# Altium schematic sheet rs485.SchDoc
size A4
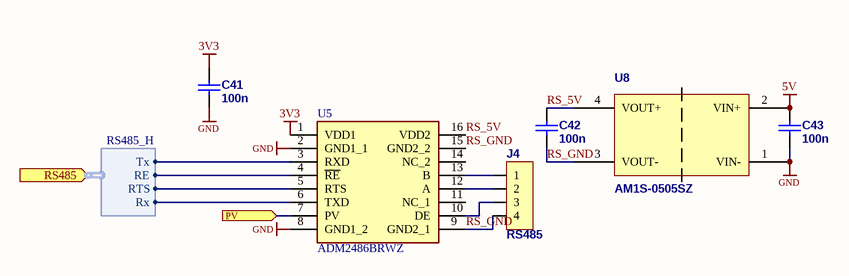
[diagram p0: rs485.SchDoc]

## Parts
C41  100n  [C0805]
C42  100n  [C0805]
C43  100n  [C0805]
J4  RS485  [15EDGRC-3.81/4P_WO_CN]
U5  ADM2486BRWZ  [SOIC127P1032X265-16N]
U8  AM1S-0505SZ  [AM1S-Z]

## Ports
PV (in), RS485 (in, harness RS485_H)

## Harnesses
RS485_H: RE, RTS, Rx, Tx

## Nets
3V3: C41.2 U5.1(VDD1)
5V: C43.1 U8.2(VIN+)
GND: C41.1 C43.2 U5.2(GND1_1) U5.8(GND1_2) U8.1(VIN-)
PV: U5.7(PV) ; port PV
RS_5V: C42.2 U5.16(VDD2) U8.4(VOUT+)
RS_GND: C42.1 J4.4 U5.9(GND2_1) U5.15(GND2_2) U8.3(VOUT-)
NetJ4_1: J4.1 U5.13(B)
NetJ4_2: J4.2 U5.12(A)
NetJ4_3: J4.3 U5.10(DE)
NetU5_3: U5.3(RXD) ; port RS485.Tx
NetU5_4: U5.4(~{RE}) ; port RS485.RE
NetU5_5: U5.5(RTS) ; port RS485.RTS
NetU5_6: U5.6(TXD) ; port RS485.Rx

Not connected (* = marked no-connect by the designer): U5 11(NC_1) 14(NC_2)

## Library data of the parts
C41-C43 = Cap: Capacitor; ComponentLink1Description: datasheet; ComponentLink2Description: supplier; Value: 100n
J4 = 2EDGVC-5.0-4P: Degson 20A, 320V, 4 Pole Plug-in Terminal Block
U5 = ADM2486BRWZ: Integrated Circuit; Manufacturer_Name: Analog Devices; Datasheet Link: http://componentsearchengine.com/Datasheets/1/ADM2486BRWZ.pdf; Height: 2.65mm; Manufacturer_Part_Number: ADM2486BRWZ; Mouser Part Number: 584-ADM2486BRWZ; Mouser Price/Stock: https://www.mouser.co.uk/ProductDetail/Analog-Devices/ADM2486BRWZ?qs=BpaRKvA4VqGSEWb6zK%252B8GA%3D%3D; Arrow Part Number: ADM2486BRWZ; Arrow Price/Stock: https://www.arrow.com/en/products/adm2486brwz/analog-devices?region=nac
U8 = AM1S-0505SZ: Aimtec 1Watt DC/DC Converter: 5V Input, 5V@200mA Output; ComponentLink1Description: Website; ComponentLink1URL: http://www.aimtec.com/; ComponentLink2Description: Datasheet; ComponentLink2URL: http://www.aimtec.com/site/Aimtec/files/Datasheet/HighResolution/AM1S-Z.pdf?ft4=6-889